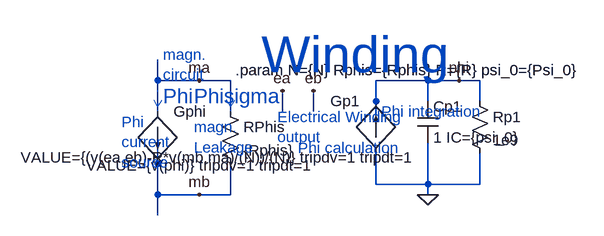
[diagram p0: schematic Winding.asc]
Winding.asc, the LTspice schematic file:
Version 4.1
SHEET 1 880 680
WIRE 48 96 48 64
WIRE 112 96 48 96
WIRE 160 96 112 96
WIRE 464 96 384 96
WIRE 512 96 464 96
WIRE 544 96 512 96
WIRE 464 128 464 96
WIRE 544 128 544 96
WIRE 48 144 48 96
WIRE 160 144 160 96
WIRE 240 144 240 112
WIRE 288 144 288 112
WIRE 384 160 384 96
WIRE 384 256 384 208
WIRE 464 256 464 192
WIRE 464 256 384 256
WIRE 544 256 544 208
WIRE 544 256 464 256
WIRE 48 272 48 192
WIRE 112 272 48 272
WIRE 160 272 160 224
WIRE 160 272 112 272
WIRE 464 272 464 256
WIRE 48 304 48 272
FLAG 112 96 ma
FLAG 112 272 mb
FLAG 240 112 ea
FLAG 288 112 eb
FLAG 464 272 0
FLAG 512 96 phi
SYMBOL bi 48 144 R0
WINDOW 3 -110 83 Left 2
SYMATTR Value VALUE={v(phi)} tripdv=1 tripdt=1
SYMATTR InstName Gphi
SYMATTR Prefix G
SYMBOL res 144 128 R0
SYMATTR InstName RPhis
SYMATTR Value {Rphis}
SYMBOL bi 384 208 R180
WINDOW 0 24 80 Left 2
WINDOW 3 -68 -7 Left 2
SYMATTR InstName Gp1
SYMATTR Value VALUE={(v(ea,eb)-R*v(mb,ma)/(N))/(N)} tripdv=1 tripdt=1
SYMATTR Prefix G
SYMBOL cap 448 128 R0
SYMATTR InstName Cp1
SYMATTR Value 1 IC={psi_0}
SYMBOL res 528 112 R0
SYMATTR InstName Rp1
SYMATTR Value 1e9
TEXT 168 80 Left 2 !.param N={N} Rphis={Rphis} R={R} psi_0={Psi_0}
TEXT 232 152 Left 2 ;Electrical Winding\noutput
TEXT 264 200 Left 2 ;Phi calculation
TEXT 392 144 Left 2 ;Phi integration
TEXT 104 168 Left 2 ;magn.\nLeakage
TEXT -8 160 Left 2 ;Phi \ncurrent\nsource
TEXT 208 56 Left 6 ;Winding
TEXT 56 56 Left 2 ;magn.\ncircuit
TEXT 56 120 Left 3 ;Phi
TEXT 104 120 Left 3 ;Phisigma
LINE Normal 48 112 48 112 2
LINE Normal 48 136 42 126 2
LINE Normal 54 127 48 136 2
LINE Normal 160 136 154 126 2
LINE Normal 166 127 160 136 2

The netlist it stands for:
* Winding.asc
Gphi ma mb VALUE={v(phi)} tripdv=1 tripdt=1
RPhis ma mb {Rphis}
Gp1 0 phi VALUE={(v(ea,eb)-R*v(mb,ma)/(N))/(N)} tripdv=1 tripdt=1
Cp1 phi 0 1 IC={psi_0}
Rp1 phi 0 1e9
.param N={N} Rphis={Rphis} R={R} psi_0={Psi_0}
* Electrical Winding
* output
* Phi calculation
* Phi integration
* magn.
* Leakage
* Phi
* current
* source
* Winding
* magn.
* circuit
* Phi
* Phisigma
.backanno
.end